# Altium schematic sheet 6v_BOOST.SchDoc
size A
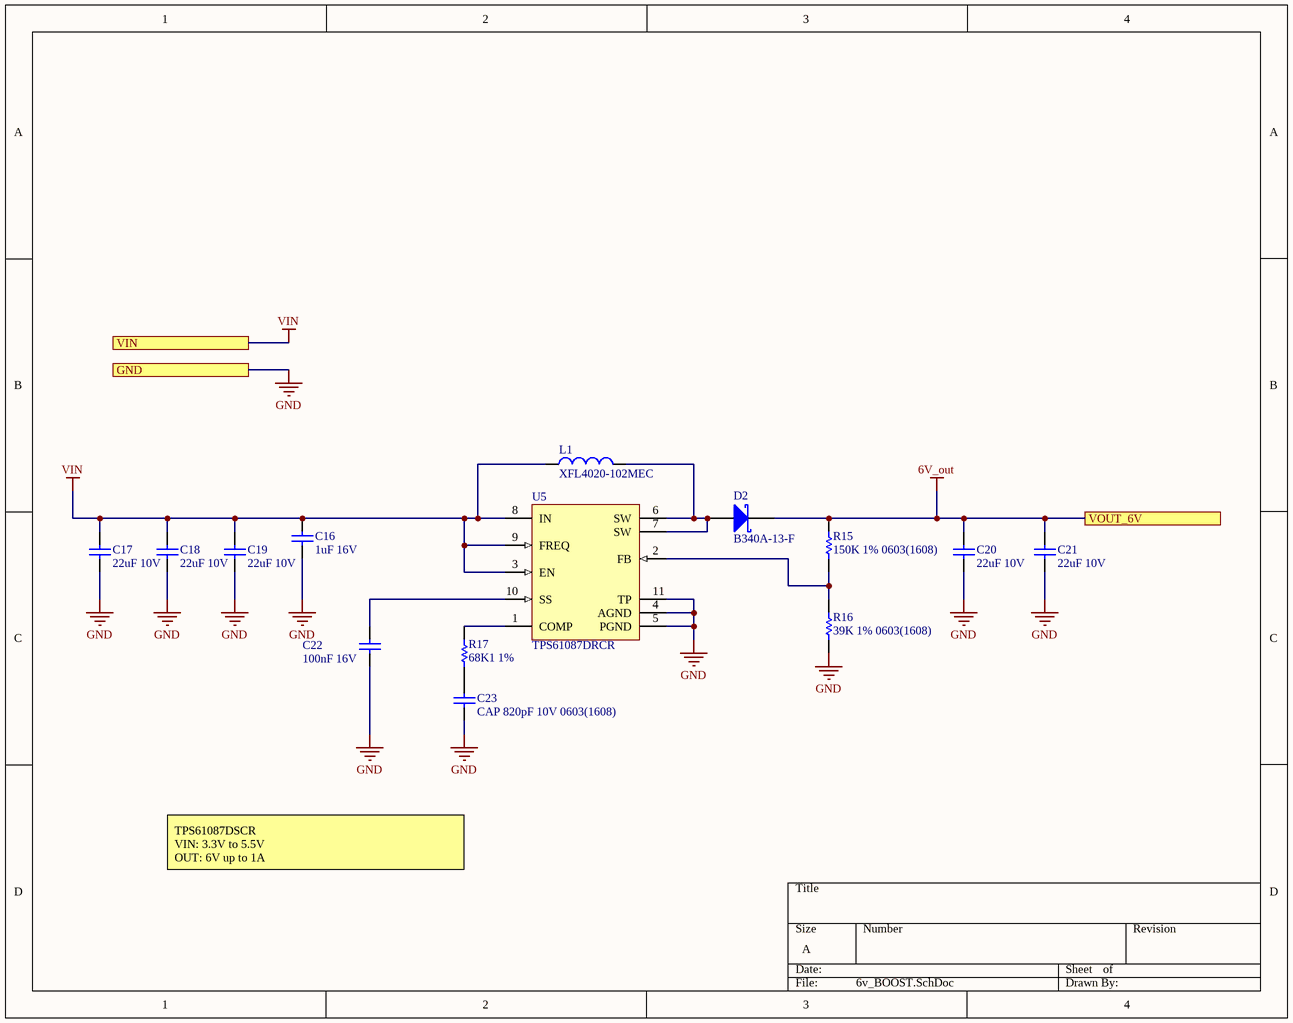
[diagram p0: 6v_BOOST.SchDoc]

## Parts
C16  1uF 16V  [CAPC0603(1608)100_N]
C17  22uF 10V  [CAPC0805(2012)145_N]
C18  22uF 10V  [CAPC0805(2012)145_N]
C19  22uF 10V  [CAPC0805(2012)145_N]
C20  22uF 10V  [CAPC0805(2012)145_N]
C21  22uF 10V  [CAPC0805(2012)145_N]
C22  100nF 16V  [CAPC0603(1608)100_N]
C23  CAP 820pF 10V 0603(1608)  [CAPC0603(1608)100_N]
D2  B340A-13-F  [DIOD-SMA-2_V]
L1  XFL4020-102MEC  [COIL-XFL4020_V]
R15  150K 1% 0603(1608)  [RESC0603(1608)_N]
R16  39K 1% 0603(1608)  [RESC0603(1608)_N]
R17  68K1 1%  [RESC0603(1608)_N]
U5  TPS61087DRCR  [DRC0010J_V]

## Ports
GND, VIN, VOUT_6V

## Nets
6V_out: C20.2 C21.2 D2.2(K) R15.2 ; port VOUT_6V
GND: C16.1 C17.1 C18.1 C19.1 C20.1 C21.1 C22.1 C23.1 R16.1 U5.4(AGND) U5.5(PGND) U5.11(TP) ; port GND
VIN: C16.2 C17.2 C18.2 C19.2 L1.1 U5.3(EN) U5.8(IN) U5.9(FREQ) ; port VIN
NetC22_2: C22.2 U5.10(SS)
NetC23_2: C23.2 R17.1
NetD2_1: D2.1(A) L1.2 U5.6(SW) U5.7(SW)
NetR15_1: R15.1 R16.2 U5.2(FB)
NetR17_2: R17.2 U5.1(COMP)

## Notes on the sheet
- TPS61087DSCR
  VIN: 3.3V to 5.5V
  OUT: 6V up to 1A

## Library data of the parts
C16 = CMP-1035-02736-1: CAP 1uF 16V ±5% 0603 (1608 Metric) Thickness 1mm SMD; Case-Metric: 1608; Case-EIA: 0603; Tolerance: Â±5%; Technology: SMT; Max Thickness: 1 mm; Rated Voltage: 16 V; Value: 1uF
C17-C21 = CMP-1036-04943-1: CAP 22uF 10V ±20% 0805 (2012 Metric) Thickness 1.45mm SMD; Case-Metric: 2012; Case-EIA: 0805; Tolerance: Â±20%; Rated Voltage: 10 V; Max Thickness: 1.45 mm; Technology: SMT; Value: 22uF
C22 = CMP-1035-02584-1: CAP 100nF 16V ±10% 0603 (1608 Metric) Thickness 1mm SMD; Tolerance: Â±10%; Case-EIA: 0603; Case-Metric: 1608; Technology: SMT; Max Thickness: 1 mm; Value: 100nF; Rated Voltage: 16 V
C23 = CMP-1035-01821-1: CAP 820pF 10V ±10% 0603 (1608 Metric) Thickness 1mm SMD; Case-EIA: 0603; Case-Metric: 1608; Tolerance: Â±10%; Max Thickness: 1 mm; Rated Voltage: 10 V; Technology: SMT; Value: 820pF
D2 = CMP-1667-00003-1: Surface Mount Schottky Barrier Rectifier, 40 V, 3 A, -55 to 150 degC, 2-Pin SMA, RoHS, Tape and Reel; Forward Current: 3 A; Forward Voltage: 500 mV; Max Surge Current: 80 A; Peak Reverse Current: 500 uA; Elements: 1; Mounting Technology: Surface Mount; ComponentLink1URL: http://www.diodes.com/; PackageDescription: 2-Pin Surface Mounted Assembly, Body 4.3 x 2.605 mm, Height 2.4 mm; Min Operating Temperature: -55 degC; Mount: Surface Mount; Pins: 2; ComponentLink2URL: http://www.diodes.com/_files/datasheets/ds30891.pdf; PackageReference: SMA-2; Max Operating Temperature: 125 degC; Radiation Hardening: No; Length: 4.6 mm; RoHSCompliant: true; ComponentLink1Description: Manufacturer URL; Height: 2.1 mm; ComponentLink2Description: Datasheet; Packaging: Tape and Reel; Package Quantity: 5000; Case\Package: SMA; DatasheetVersion: Rev. 17 - 2, 09/2015; REACH SVHC: No SVHC; Width: 2.92 mm
L1 = CMP-2000-07423-1: Shielded Power Inductor, 1 uH, 64 MHz, -40 to 125 degC, 2-Pin SMD, RoHS, Tape and Reel; Manufacturer: Coilcraft; Case Width: 4.3mm; Case Height: 2.1mm; Maximum DC Current: 11A; Core Material: Composite; Test Frequency: 100kHz; Tolerance: 20%; Maximum DC Resistance: 11.9mOhms; Inductance: 1uH; Self Resonant Frequency: 64MHz; RoHS: Details; Series: XFL4020; Case Length: 4.3mm; Package Reference: XFL4020; Dimensions: 4.3mmWx4.3mmLx2.1mmH; Product: PowerInductors; Datasheet Version: 07/2012; Manufacturer URL: http://www.coilcraft.com/; Termination Style: SMD/SMT; Mounting Technology: SurfaceMount; Operating Temperature Range: -40Cto+125C; Package Description: 2-Pin Surface Mount Device, Body 4 x 4 mm, Pitch 2.37 mm; Shielding: Shielded; Packaging: Reel; Datasheet URL: http://www.mouser.com/ds/2/597/xfl4020-270756.pdf
R15 = CMP-1012-00754-1: 150K 0.1W 1% 0603 (1608 Metric)  SMD; Case-EIA: 0603; Case-Metric: 1608; Value: 150000.00 Ohm; Tolerance: 1 %; Power: 0.1 W; Technology: SMT
R16 = CMP-1012-00689-1: 39K 0.1W 1% 0603 (1608 Metric)  SMD; Case-Metric: 1608; Case-EIA: 0603; Value: 39000.00 Ohm; Technology: SMT; Tolerance: 1 %; Power: 0.1 W
R17 = CMP-1012-00718-1: 68K1 0.1W 1% 0603 (1608 Metric)  SMD; Case-EIA: 0603; Case-Metric: 1608; Value: 68100.00 Ohm; Technology: SMT; Power: 0.1 W; Tolerance: 1 %
U5 = CMP-0343-00035-2: Boost Voltage Converter with 2.5 to 6 V Input and 3 to 18.5 V Output, -40 to 85 degC, 10-Pin SON (DRC), Green (RoHS & no Sb/Br); Manufacturer: Texas Instruments; Vout(Max)(V): 18.5; Switching Frequency(Typ)(kHz): 650, 1200; SubFamily: Step-Up Regulator; Regulated Outputs(#): 1; Vout(Min)(V): 3; Vin(Min)(V): 2.5; Vin(Max)(V): 6; PartNumber: TPS61087DRCR; ComponentLink1Description: Datasheet; Mounting Technology: Surface Mount; Eco-Plan: Green (RoHS & no Sb/Br); Topology: Boost; PackageVersion: revL, Sep-2011; DatasheetVersion: SLVS821B; ComponentLink1URL: http://www.ti.com/general/docs/lit/getliterature.tsp?genericPartNumber=TPS61087&fileType=pdf; ComponentLink2URL: http://www.ti.com/litv/pdf/mpds117k; ComponentLink2Description: Package Specification; PackageDescription: 10-Pin Plastic Small Outline No-Lead, 3 x 3 x 1 mm Body, 0.5 mm Pitch, Exposed Pad; PackageReference: DRC0010J